# EAGLE design cdc (EAGLE 6.6.0)
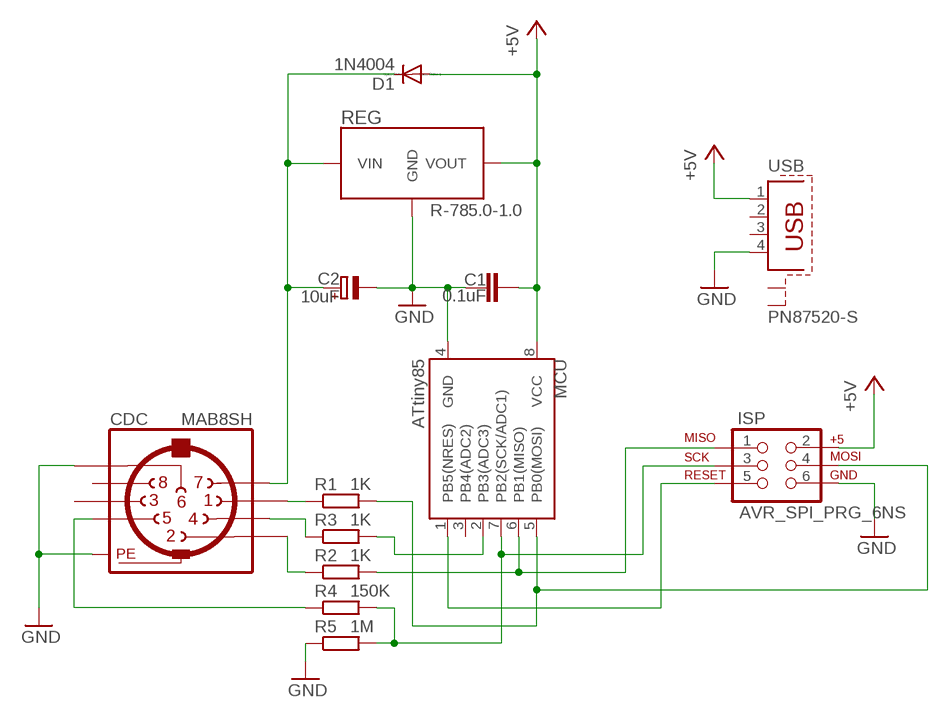
[diagram p0: schematic, sheet 1]

## Parts
C1  0.1uF  C5/3  [C5B3]
C2  10uF  CPOL-EUE1.8-4  [E1,8-4]
CDC  MAB8SH  [MAB8SH]
D1  1N4004  [DO41-10]
ISP  AVR_SPI_PRG_6NS  [2X3-NS]
MCU  ATtiny85  ATTINY45TINY45-20-DIP  [DIP08]
R1  1K  R-EU_0207/7  [0207/7]
R2  1K  R-EU_0207/7  [0207/7]
R3  1K  R-EU_0207/7  [0207/7]
R4  150K  R-EU_0207/7  [0207/7]
R5  1M  R-EU_0207/7  [0207/7]
REG  VREG-RECOM-785.0-1.0  [VREG-RECOM-785.0-1.0]
USB  PN87520-S  [PN87520-S]

## Nets
+5V [power]: C1.2 D1.A ISP.2 MCU.8(VCC) REG.VOUT USB.1
GND [power]: C1.1 C2.- CDC.6 CDC.PE CDC.PE@(PE) ISP.6 MCU.4(GND) R5.1 REG.GND USB.4
N$1 [power]: C2.+ CDC.7 D1.C REG.VIN
N$2: ISP.4 MCU.5(PB0(MOSI)) R1.2
N$3: ISP.1 MCU.6(PB1(MISO)) R2.2
N$4: MCU.2(PB3(ADC3)) R3.2
N$5: ISP.5 MCU.1(PB5(NRES))
N$6: ISP.3 MCU.7(PB2(SCK/ADC1)) R4.2 R5.2
N$7: CDC.2 R2.1
N$8: CDC.4 R3.1
N$9: CDC.1 R1.1
N$10: CDC.5 R4.1
Unconnected: CDC.3 CDC.8 MCU.3(PB4(ADC2)) USB.2 USB.3 USB.S1 USB.S2

## Library data of the parts
C1 = capacitor-wima:C: CAPACITOR naming: grid - package width
C2 = rcl:CPOL-EU: POLARIZED CAPACITOR, European symbol
CDC = con-hirschmann:MAB8SH: Female CONNECTOR 8 pins with shield, horizontal (DIN 41524); MF: FARNELL; MPN: MAB 8 SH; OC_FARNELL: 809913; OC_NEWARK: 67C7888
D1 = diode:1N4004: DIODE general purpose rectifier, 1 A
ISP = SparkFun-Connectors:AVR_SPI_PRG_6: AVR ISP 6 Pin This is the reduced ISP connector for AVR programming. Common on Arduino. This footprint will take up less PCB space and can be used with a 10-pin to 6-pin adapter such as SKU: BOB-08508 **Special note about "TEST_POINT" package. The stop mask is on the top side, so if you want your programming test points to be on the bottom of your board, make sure to place this package on the bottom side of the board. This also ensure that the orientation to program from the bottom side will be correct.
MCU = SparkFun-DigitalIC:ATTINY45: Atmel 8-pin 2/4/8kB flash uC; PROD_ID: IC-09439; VALUE: TINY45-20-DIP
R1-R5 = rcl:R-EU_: RESISTOR, European symbol
REG = vreg-recom-r-7850-1:VREG-RECOM-785.0-1.0
USB = con-berg:PN87520-S; OC_FARNELL: 2112381; OC_NEWARK: unknown

## Net classes
0 default: width 0.203 mm
1 power: width 0.457 mm

## Board
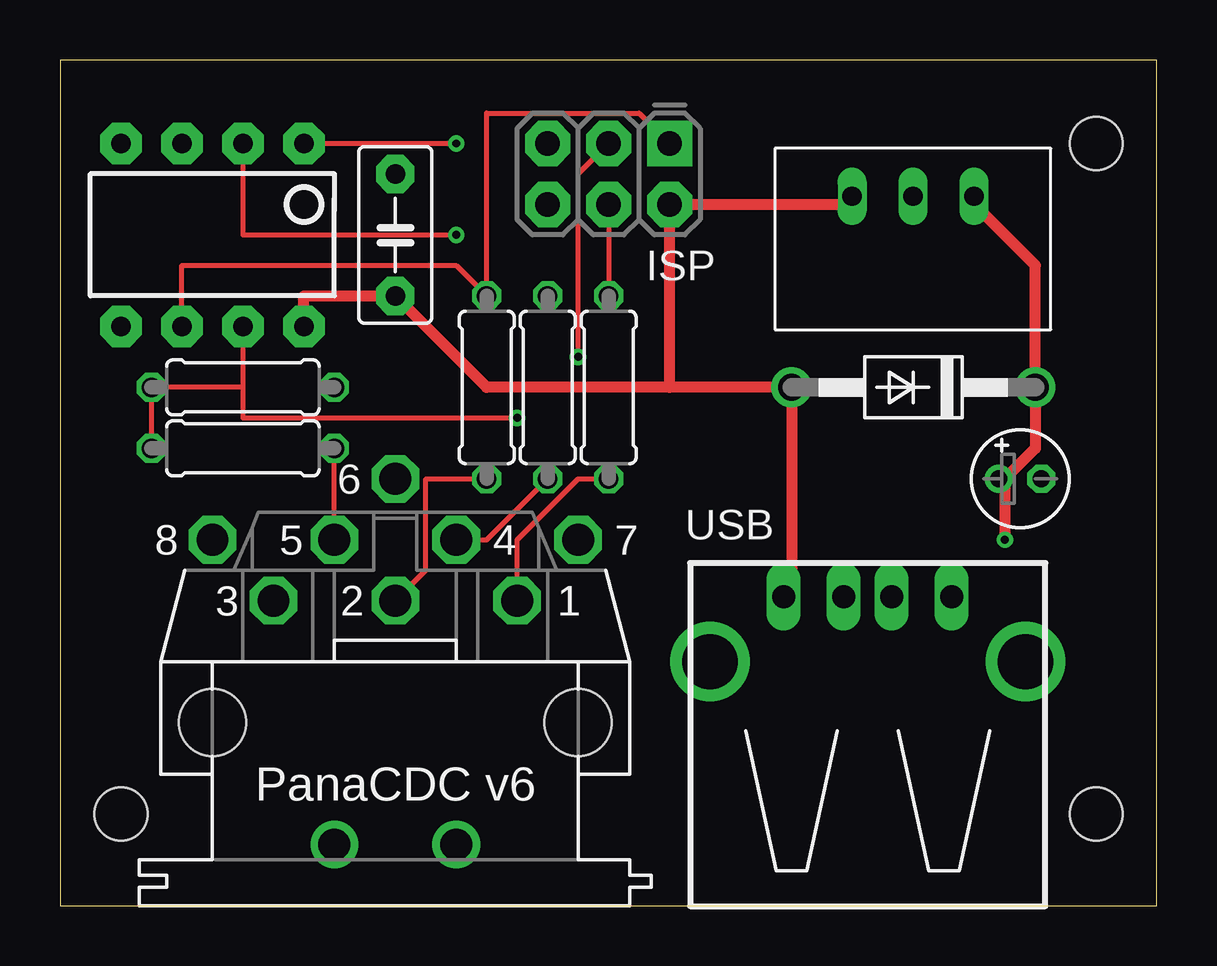
[diagram p1: board, top side]
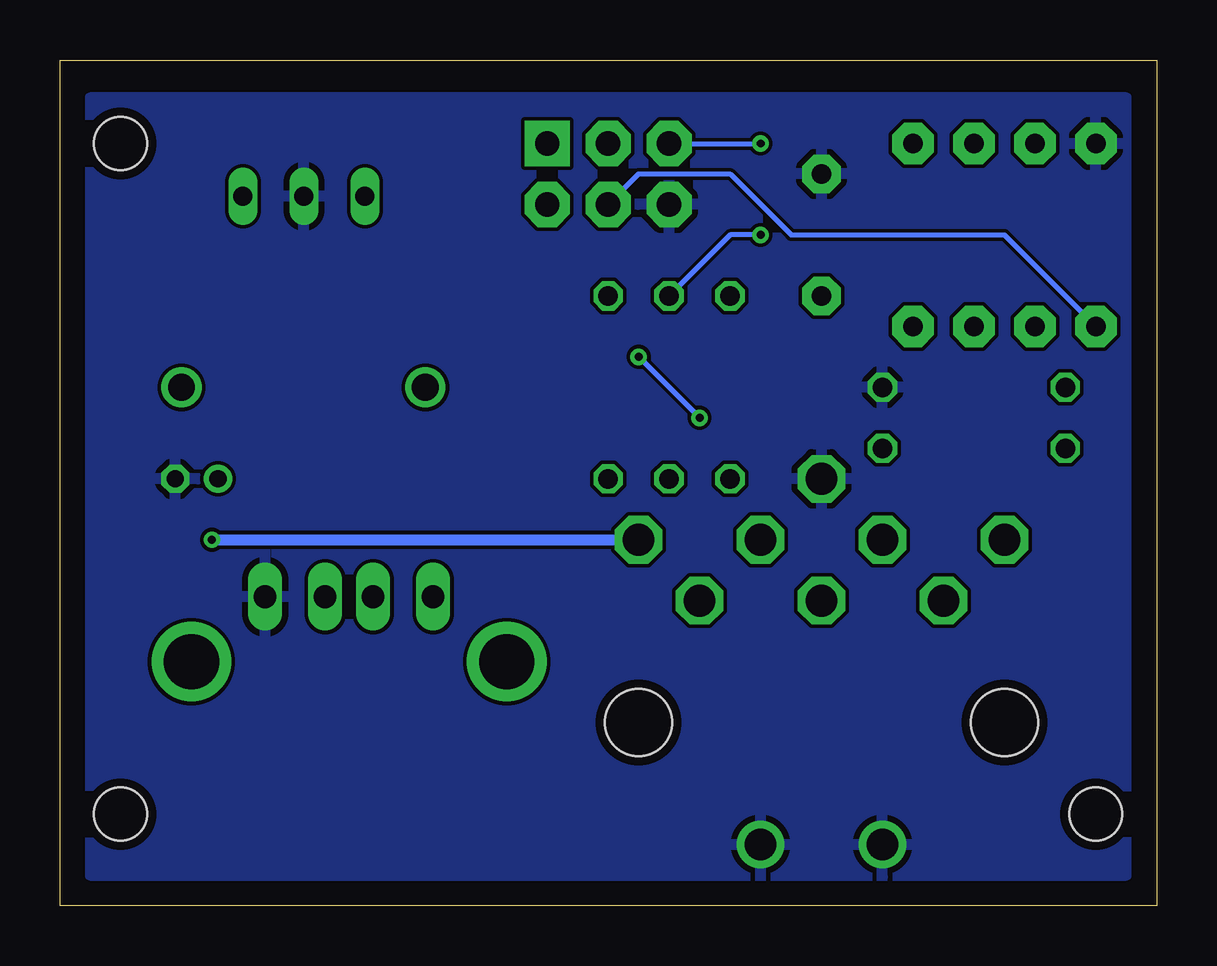
[diagram p2: board, bottom side, seen from below]

Size 45.7 x 35.23 mm. Coordinates in mm from the lower left corner, seen from the top.
Outline: 0,0 45.7,0 45.7,35.23 0,35.23 0,0
Copper layers (1*16): Top 0.0356mm / dielectric 1.5011mm / Bottom 0.0356mm
Design rules "oshpark-2layer": minimum track width 6mil, minimum drill 13mil, track to track 6mil, track to pad 6mil, pad to pad 6mil, via to via 6mil, smd to smd 6mil, copper to edge 15mil, drill to drill 6mil, minimum pad ring 7mil, minimum via ring 7mil, stop-mask expansion 4mil, vias tented up to drill 0mil, thermal gap 10mil
Holes 2.2 mm at 2.54,3.81 43.18,3.81 43.18,31.75

### Footprints (pad centres in the part's own frame; a part is rotated, then mirrored left to right if it is on the bottom)
C5B3 = drill 0.813 pad 1.6 octagon: 1 -2.54,0; 2 2.54,0
E1,8-4 = drill 0.711 pad 1.168: + -0.889,0 | drill 0.711 pad 1.168 octagon: - 0.889,0
MAB8SH = drill 1.321 octagon: 1 5.08,5.08; 2 0,5.08; 3 -5.08,5.08; 4 2.54,7.62; 5 -2.54,7.62; 6 0,10.16; 7 7.62,7.62; 8 -7.62,7.62 | drill 1.321: PE -2.54,-5.08; PE@ 2.54,-5.08 | hole 2.794: -7.62,0; 7.62,0
DO41-10 = drill 1.118: A 5.08,0; C -5.08,0
2X3-NS = drill 1.016 pad 1.88 square: 1 -2.54,-1.27 | drill 1.016 pad 1.88 octagon: 2 -2.54,1.27; 3 0,-1.27; 4 0,1.27; 5 2.54,-1.27; 6 2.54,1.27
DIP08 = drill 0.813 pad 1.727 octagon: 1 -3.81,-3.81; 2 -1.27,-3.81; 3 1.27,-3.81; 4 3.81,-3.81; 5 3.81,3.81; 6 1.27,3.81; 7 -1.27,3.81; 8 -3.81,3.81
0207/7 = drill 0.813 octagon: 1 -3.81,0; 2 3.81,0
VREG-RECOM-785.0-1.0 = drill 0.8 long: GND 0.02,-1.61; VIN -2.52,-1.61; VOUT 2.56,-1.61
PN87520-S = drill 0.95 long: 1 -3.5,2.71; 2 -1,2.71; 3 1,2.71; 4 3.5,2.71 | drill 2.3 pad 2.9: S1 -6.57,0; S2 6.57,0

### Placement (x,y rotation side)
C1  13.97,27.94 270 top
C2  40.01,17.78 0 top
CDC  13.97,7.62 0 top
D1  35.56,21.59 180 top
ISP  22.86,30.48 180 top
MCU  6.35,27.94 180 top
R1  22.86,21.59 90 top
R2  17.78,21.59 90 top
R3  20.32,21.59 90 top
R4  7.62,19.05 180 top
R5  7.62,21.59 180 top
REG  35.56,27.94 180 top
USB  33.66,10.16 0 top

### Tracks (layer width: path | path; a pad name or v marks a point on that pad's centre or on a via)
+5V
  Top 0.457: REG.VOUT 33.02,29.21 ISP.2 25.4,21.59 | MCU.8 10.16,25.4 C1.2 17.78,21.59 25.4,21.59 | USB.1 30.48,13.97 D1.A 25.4,21.59
GND
  pour Bottom: 1.27,1.27 1.27,33.66 44.45,33.66 44.45,1.27
N$1  (via drill 0.33)
  Top 0.457: 39.37,17.78 40.64,19.05 D1.C 40.64,26.67 38.1,29.21 REG.VIN | 39.37,17.78 v39.37,15.24 | 39.37,17.78 C2.+
  Bottom 0.457: v39.37,15.24 CDC.7
N$2
  Top 0.203: ISP.4 R1.2
  Bottom 0.203: MCU.5 6.35,27.94 15.24,27.94 17.78,30.48 21.59,30.48 ISP.4
N$3
  Top 0.203: MCU.6 5.08,26.67 16.51,26.67 R2.2 17.78,33.02 24.13,33.02 ISP.1
N$4  (via drill 0.33)
  Top 0.203: v16.51,27.94 7.62,27.94 MCU.2
  Bottom 0.203: R3.2 17.78,27.94 v16.51,27.94
N$5  (via drill 0.33)
  Top 0.203: v16.51,31.75 MCU.1
  Bottom 0.203: ISP.5 v16.51,31.75
N$6  (via drill 0.33)
  Top 0.203: R4.2 R5.2 7.62,21.59 | MCU.7 7.62,21.59 | ISP.3 21.59,30.48 v21.59,22.86 | v19.05,20.32 7.62,20.32 7.62,21.59
  Bottom 0.203: v19.05,20.32 v21.59,22.86
N$7
  Top 0.203: R2.1 15.24,17.78 15.24,13.97 CDC.2
N$8
  Top 0.203: R3.1 17.78,15.24 CDC.4
N$9
  Top 0.203: R1.1 21.59,17.78 19.05,15.24 CDC.1
N$10
  Top 0.203: CDC.5 R4.1

### Text on the board
tNames: PanaCDC v6